# Altium schematic sheet Temp_Meas.SchDoc
size A
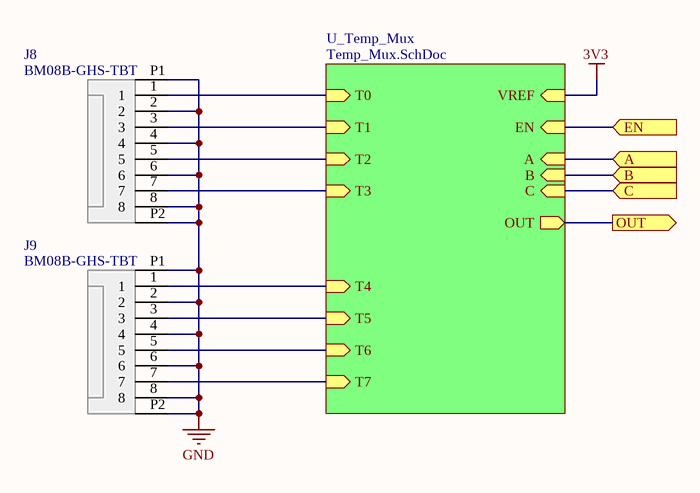
[diagram p0: Temp_Meas.SchDoc]

## Parts
J8  BM08B-GHS-TBT  [J_BM08B-GHS-TBT]
J9  BM08B-GHS-TBT  [J_BM08B-GHS-TBT]

## Sub-sheets
U_Temp_Mux = Temp_Mux.SchDoc: T0 (in), A (in), B (in), EN (in), OUT (out), T1 (in), T2 (in), T3 (in), T4 (in), T5 (in), T6 (in), T7 (in), VREF (in), C (in)

## Ports
A (in), B (in), C (in), EN (in), OUT (out)

## Nets
3V3: sheet U_Temp_Mux/VREF
GND: J8.2 J8.4 J8.6 J8.8 J8.P1 J8.P2 J9.2 J9.4 J9.6 J9.8 J9.P1 J9.P2
A: port A, sheet U_Temp_Mux/A
B: port B, sheet U_Temp_Mux/B
C: port C, sheet U_Temp_Mux/C
EN: port EN, sheet U_Temp_Mux/EN
OUT: port OUT, sheet U_Temp_Mux/OUT
NetJ8_1: J8.1 ; sheet U_Temp_Mux/T0
NetJ8_3: J8.3 ; sheet U_Temp_Mux/T1
NetJ8_5: J8.5 ; sheet U_Temp_Mux/T2
NetJ8_7: J8.7 ; sheet U_Temp_Mux/T3
NetJ9_1: J9.1 ; sheet U_Temp_Mux/T4
NetJ9_3: J9.3 ; sheet U_Temp_Mux/T5
NetJ9_5: J9.5 ; sheet U_Temp_Mux/T6
NetJ9_7: J9.7 ; sheet U_Temp_Mux/T7

## Library data of the parts
J8 J9 = J_BM08B-GHS-TBT: Connector Header Surface Mount 8 position 0.049" (1.25mm); Manufacturer: JST; Manufacturer Part Number: BM08B-GHS-TBT(LF)(SN); Current Rating: 1A; Voltage Rating: 50V; Wire/Cable Gauge: 26AWG; Supplier 1: Digi-Key; Supplier Part Number 1: 455-1584-1-ND; Contact Material: Bronze; Contact Plating: Tin; Housing Material: Nylon; Max Operating Temperature: 85°C; Min Operating Temperature: -25°C; Pitch: 1.25mm; Voltage Rating (AC): 50V